# EAGLE design joystick (EAGLE 9.2.2)
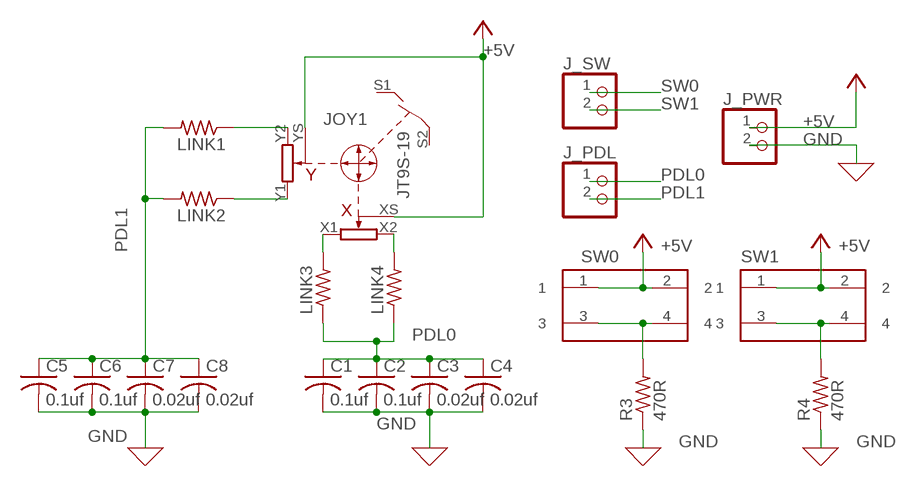
[diagram p0: schematic, sheet 1]

## Parts
C1  0.1uf  C-USC0805  [C0805]
C2  0.1uf  C-USC0805  [C0805]
C3  0.02uf  C-USC0805  [C0805]
C4  0.02uf  C-USC0805  [C0805]
C5  0.1uf  C-USC0805  [C0805]
C6  0.1uf  C-USC0805  [C0805]
C7  0.02uf  C-USC0805  [C0805]
C8  0.02uf  C-USC0805  [C0805]
J_PDL  PINHD-1X2  [1X02]
J_PWR  PINHD-1X2  [1X02]
J_SW  PINHD-1X2  [1X02]
JOY1  JT9S-19  [JT9S-1P]
LINK1  0  R-US_R0805  [R0805]
LINK2  0  R-US_R0805  [R0805]
LINK3  0  R-US_R0805  [R0805]
LINK4  0  R-US_R0805  [R0805]
R3  470R  R-US_R0805  [R0805]
R4  470R  R-US_R0805  [R0805]
SW0  430476073716  [430476073716]
SW1  430476073716  [430476073716]

## Nets
+5V: J_PWR.1 JOY1.XS JOY1.YS SW0.1 SW0.2 SW1.1 SW1.2 ; supply symbol labelled VCC
GND: C1.2 C2.2 C3.2 C4.2 C5.2 C6.2 C7.2 C8.2 J_PWR.2 R3.1 R4.1
N$1: JOY1.X1 LINK3.2
N$2: JOY1.X2 LINK4.2
N$3: JOY1.Y1 LINK2.1
N$4: JOY1.Y2 LINK1.1
PDL0 [Signal]: C1.1 C2.1 C3.1 C4.1 J_PDL.1 LINK3.1 LINK4.1
PDL1 [Signal]: C5.1 C6.1 C7.1 C8.1 J_PDL.2 LINK1.2 LINK2.2
SW0 [Signal]: J_SW.1 R3.2 SW0.3 SW0.4
SW1 [Signal]: J_SW.2 R4.2 SW1.3 SW1.4
Unconnected: JOY1.S1 JOY1.S2

## Library data of the parts
C1-C8 = rcl:C-US: CAPACITOR, American symbol; SPICEPREFIX: C
J_PDL J_PWR J_SW = pinhead:PINHD-1X2: PIN HEADER
JOY1 = jt9s-1p:JT9S-19: Joystick Potentiometer 10k
LINK1-LINK4 R3 R4 = rcl:R-US_: RESISTOR, American symbol; SPICEPREFIX: R
SW0 SW1 = Wurth_Elektronik_Electromechanic_Switch_rev16d:430476073716: WS-TSW, 12*12mm horizontal type washable Tact switch, ,THT, 4 pins, height 7.3mm, square black actuator, 160gf

## Net classes
0 Power: width 0.61 mm, clearance 0.406 mm
1 Signal: width 0.508 mm, clearance 0.406 mm

## Board
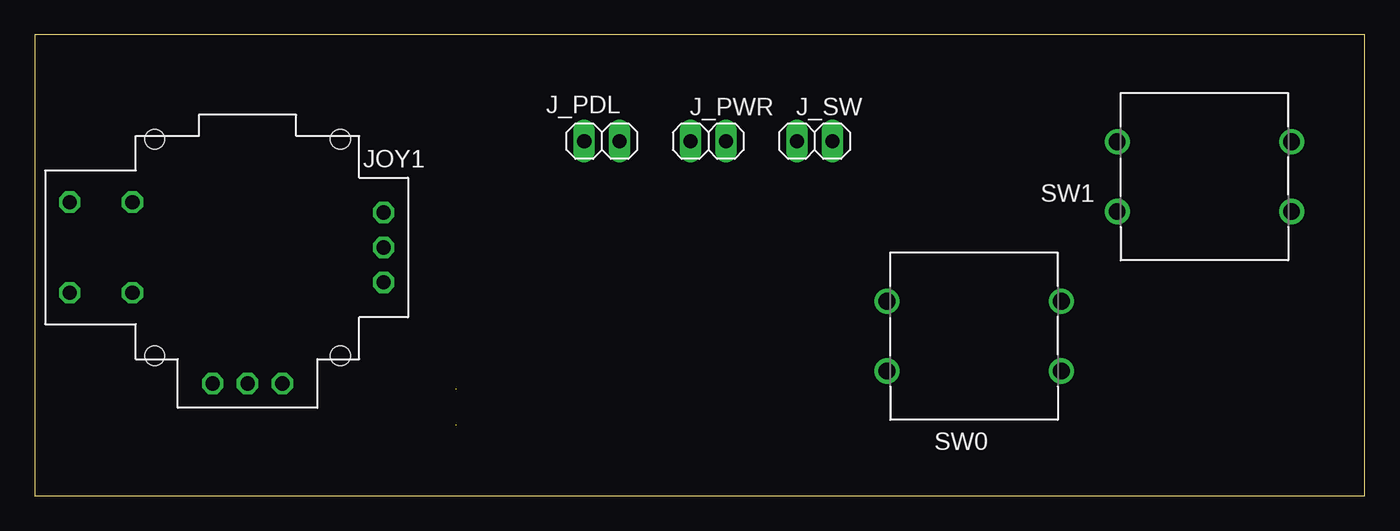
[diagram p1: board, top side]
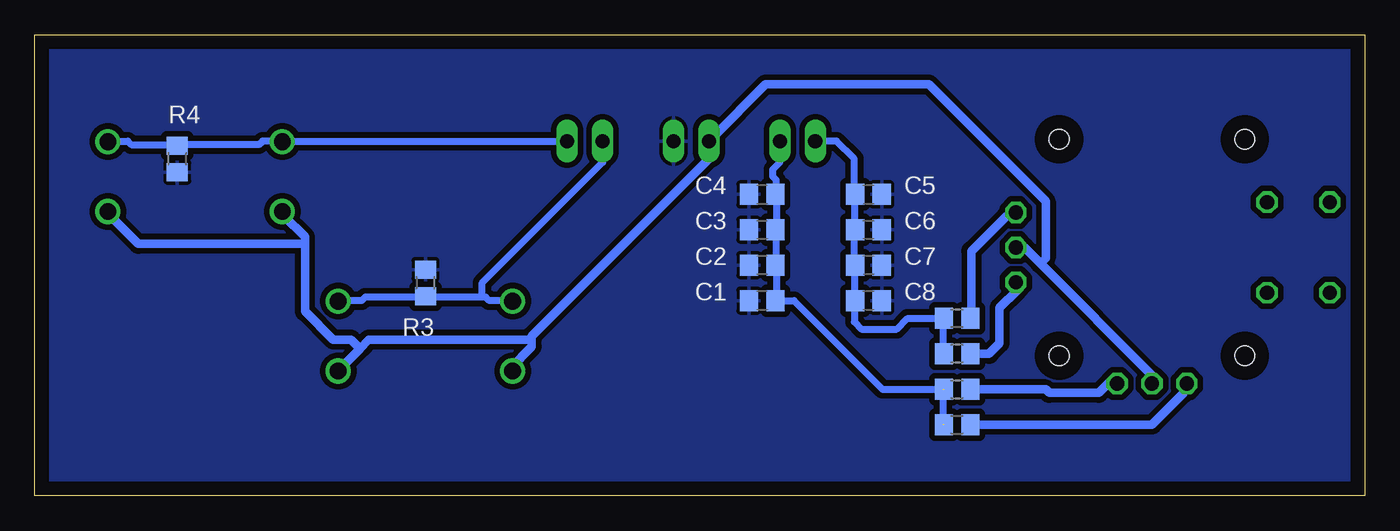
[diagram p2: board, bottom side, seen from below]

Size 95.3 x 33.01 mm. Coordinates in mm from the lower left corner, seen from the top.
Outline: 0,0 95.3,0 95.3,33.01 0,33.01 0,0
Copper layers (1*16): Top 0.035mm / dielectric 1.5mm / Bottom 0.035mm
Design rules "default": minimum track width 6mil, minimum drill 0.35mm, track to track 6mil, track to pad 6mil, pad to pad 6mil, via to via 6mil, smd to smd 6mil, copper to edge 40mil, drill to drill 6mil, minimum pad ring 10mil, minimum via ring 8mil, stop-mask expansion 4mil, vias tented up to drill 0mil, thermal gap 10mil

### Footprints (pad centres in the part's own frame; a part is rotated, then mirrored left to right if it is on the bottom)
C0805 = smd 1.3 x 1.5: 1 -0.95,0; 2 0.95,0
1X02 = drill 1.016 long: 1 -1.27,0; 2 1.27,0
JT9S-1P = drill 1.016 octagon: S1 8.25,-3.25; S2 12.75,3.25; S3 12.75,-3.25; S4 8.25,3.25; X1 -2.5,9.75; X2 2.5,9.75; XS 0,9.75; Y1 -9.75,2.5; Y2 -9.75,-2.5; YS -9.75,0 | hole 1.422: -6.65,7.75; 6.65,7.75; 6.65,-7.75; -6.65,-7.75
R0805 = smd 1.3 x 1.5: 1 -0.95,0; 2 0.95,0
430476073716 = drill 1.2: 1 -6.25,2.5; 2 6.25,2.5; 3 -6.25,-2.5; 4 6.25,-2.5

### Placement (x,y rotation side)
C1  43.18,13.97 180 bottom
C2  43.18,16.51 180 bottom
C3  43.18,19.05 180 bottom
C4  43.18,21.59 180 bottom
C5  35.56,21.59 0 bottom
C6  35.56,19.05 0 bottom
C7  35.56,16.51 0 bottom
C8  35.56,13.97 0 bottom
J_PDL  40.64,25.4 180 top
J_PWR  48.26,25.4 0 top
J_SW  55.88,25.4 0 top
JOY1  15.24,17.78 180 top
LINK1  29.21,12.7 180 bottom
LINK2  29.21,10.16 180 bottom
LINK3  29.21,7.62 0 bottom
LINK4  29.21,5.08 0 bottom
R3  67.31,15.24 270 bottom
R4  85.09,24.13 90 bottom
SW0  67.31,11.43 180 top
SW1  83.82,22.86 180 top

### Tracks (layer width: path | path; a pad name or v marks a point on that pad's centre or on a via)
+5V
  Bottom 0.61: JOY1.XS 15.24,8.64 23.24,16.64 | 23.24,16.64 24.38,17.78 JOY1.YS | 59.69,11.18 59.69,10.67 61.21,9.14 SW0.2 | 59.69,11.18 59.69,11.43 46.99,24.13 J_PWR.1 46.99,25.65 46.74,25.65 42.93,29.46 31.24,29.46 22.86,21.08 22.86,17.02 23.24,16.64 | 72.01,10.54 71.37,11.18 59.69,11.18 | 72.01,10.54 73.41,9.14 SW0.1 | 75.95,18.03 75.95,13.21 73.91,11.18 72.64,11.18 72.01,10.54 | 75.95,18.03 75.95,18.54 77.47,20.07 77.47,20.32 SW1.2 | 75.95,18.03 87.88,18.03 89.92,20.07 89.92,20.32 SW1.1
GND
  pour Bottom: 0,33.02 0,0 95.25,0 95.25,33.02
N$1
  Bottom 0.61: LINK3.2 22.86,7.62 22.61,7.37 19.05,7.37 18.29,8.13 17.78,8.13 JOY1.X1
N$2
  Bottom 0.61: LINK4.2 15.24,5.08 12.95,7.37 12.95,7.87 JOY1.X2
N$3
  Bottom 0.61: LINK2.1 26.92,10.16 26.16,10.92 26.16,13.46 24.89,14.73 24.89,15.24 JOY1.Y1
N$4
  Bottom 0.61: LINK1.1 28.19,12.7 28.19,17.53 25.65,20.07 25.15,20.07 JOY1.Y2
PDL0  (2 unrouted)
  Bottom 0.508: 42.16,21.59 42.16,19.05 | 30.23,5.08 30.23,7.62 34.54,7.62 40.89,13.97 42.16,13.97 | 42.16,16.51 42.16,13.97 | 42.16,13.97 C1.1 | 42.16,16.51 42.16,19.05 | 42.16,19.05 C3.1 | 42.16,16.51 C2.1 | J_PDL.1 41.91,23.88 42.42,23.37 42.42,22.86 42.16,22.61 42.16,21.59 | 42.16,21.59 C4.1
PDL1
  Bottom 0.508: 36.58,21.59 36.58,19.05 | 30.23,12.7 30.23,10.16 LINK2.2 | 36.58,16.51 36.58,13.97 | 30.23,12.7 32.77,12.7 33.53,11.94 36.07,11.94 36.58,12.45 36.58,13.97 | 30.23,12.7 LINK1.2 | 36.58,13.97 C8.1 | 36.58,16.51 36.58,19.05 | 36.58,19.05 C6.1 | 36.58,16.51 C7.1 | J_PDL.2 37.85,25.4 36.58,24.13 36.58,21.59 | 36.58,21.59 C5.1
SW0
  Bottom 0.508: 63.25,14.22 62.99,14.22 62.74,13.97 61.21,13.97 SW0.4 | 63.25,14.22 67.31,14.22 | J_SW.1 54.61,23.88 63.25,15.24 63.25,14.22 | 67.31,14.22 71.63,14.22 71.88,13.97 73.41,13.97 SW0.3 | 67.31,14.22 R3.2
SW1
  Bottom 0.508: 85.09,25.15 88.39,25.15 88.65,25.4 89.92,25.4 SW1.3 | J_SW.2 77.47,25.4 SW1.4 77.72,25.4 78.99,25.4 79.25,25.15 85.09,25.15 | 85.09,25.15 R4.2